# EasyEDA Pro project bandolibre.eprj, schematic GatedWingConnector
Board Name: GatedWingConnector; Create Date: 2026-05-05; Page Name: P1; Project Name: bandoneo; Schematic Name: GatedWingConnector; Update Date: 2026-05-05; Company: EasyEDA.com; Page Size: A4; Version: V1.0
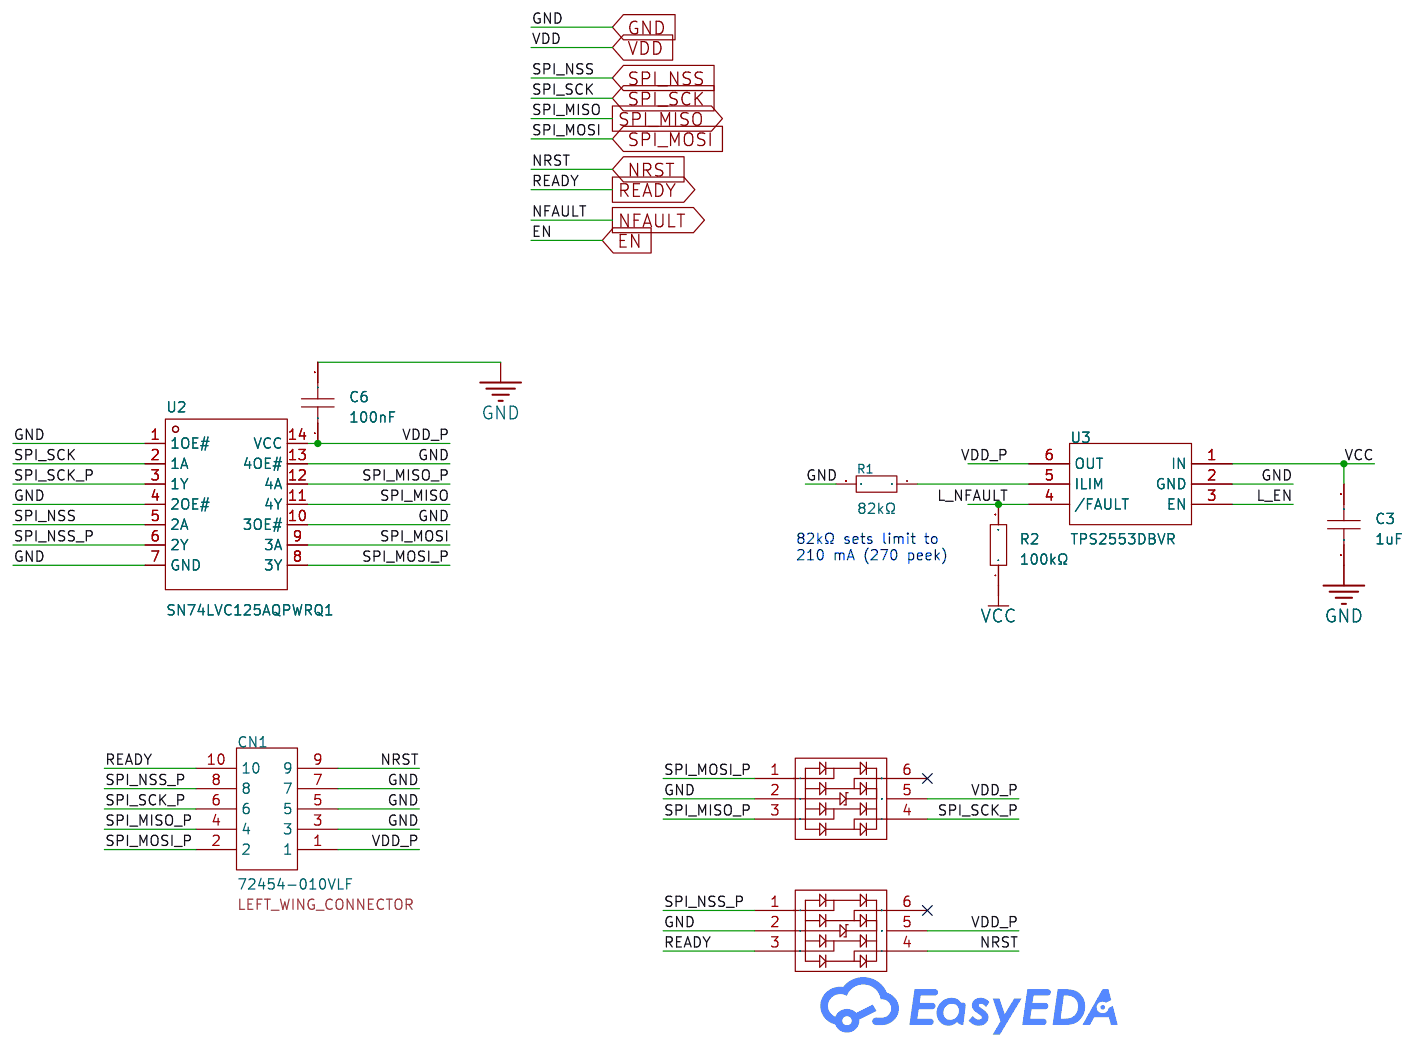
[diagram p1: schematic sheet]

## Parts
C3  1uF  [C0603]
C6  100nF  [C0603]
CN1  72454-010VLF  [CONN-SMD_10P-P2.54_72454-010VLF]
R1  82kΩ  [R0603]
R2  100kΩ  [R0603]
TV1  SRV05-4-P-T7  [SOT-23-6_L2.9-W1.6-P0.95-LS2.8-BR]
TV2  SRV05-4-P-T7  [SOT-23-6_L2.9-W1.6-P0.95-LS2.8-BR]
U2  SN74LVC125AQPWRQ1  [TSSOP-14_L5.0-W4.4-P0.65-LS6.4-BL]
U3  TPS2553DBVR  [SOT-23-6_L2.9-W1.6-P0.95-LS2.8-BR]

## Library data of the parts
C3 = CL10A105KB8NNNC: Temperature Coefficient: Tolerance: Tolerance: Voltage Rated: Capacitance:; LCSC Part Name: 1uF(105) ±10% 50V; Supplier Part: C15849; Manufacturer: SAMSUNG(三星); Supplier Footprint: 0603; JLCPCB Part Class: Basic Part; Datasheet: https://atta.szlcsc.com/upload/public/pdf/source/20160103/1457707679084.pdf; Supplier: LCSC
C6 = CC0603KRX7R9BB104: Capacitance: Tolerance:±10% Tolerance:±10% Voltage Rated: Temperature Coefficient:; LCSC Part Name: 100nF ±10% 50V; Supplier Part: C14663; Manufacturer: YAGEO(国巨); Supplier Footprint: 0603; JLCPCB Part Class: Basic Part; Datasheet: https://atta.szlcsc.com/upload/public/pdf/source/20170116/1484561234239.pdf; Supplier: LCSC; Tolerance: ±10%
CN1 = 72454-010VLF: Pins Structure:2x5P Pitch:2.54mm Mounting Type:Surface Mount,Vertical Reference Series:- Number of Pins:10P Number of Rows:2 Number of PINs Per Row:5 Row Spacing:2.54mm Current Rating:1A Contact Material:Phosphor Bronze Contact Plating:Tin Operating Tempe; LCSC Part Name: 2x5P 间距:2.54mm 立贴; Supplier Part: C236047; Manufacturer: Amphenol; Supplier Footprint: SMD,P=2.54mm; JLCPCB Part Class: Extended Part; Datasheet: https://item.szlcsc.com/datasheet/72454-010VLF/235722.html; Supplier: LCSC; Pins Structure: 2x5P; Pitch: 2.54mm; Mounting Type: Surface Mount,Vertical; Number of Pins: 10P; Number of Rows: 2; Number of PINs Per Row: 5; Row Spacing: 2.54mm; Current Rating: 1A; Contact Material: Phosphor Bronze; Contact Plating: Tin; Operating Temperature: -65℃~+105℃; Comment: LEFT_WING_CONNECTOR
R1 = 0603WAF8202T5E: Type:Thick Film Resistor Resistance:82kΩ Tolerance:±1% Tolerance:±1% Power(Watts):100mW Voltage-Supply(Max):75V Temperature Coefficient:±100ppm/℃ Temperature Coefficient:±100ppm/℃ Operating Temperature:-55℃~+155℃ Operating Temperature:-55℃~+155℃; LCSC Part Name: 82kΩ ±1% 100mW 厚膜电阻; Supplier Part: C23254; Manufacturer: UNI-ROYAL(厚声); Supplier Footprint: 0603; JLCPCB Part Class: Basic Part; Datasheet: https://item.szlcsc.com/datasheet/0603WAF8202T5E/23981.html; Supplier: LCSC; Type: Thick Film Resistor; Tolerance: ±1%; Power(Watts): 100mW; Voltage-Supply(Max): 75V; Temperature Coefficient: ±100ppm/℃; Operating Temperature: -55℃~+155℃
R2 = 0603WAF1003T5E: Type:Thick Film Resistor Resistance:100kΩ Tolerance:±1% Tolerance:±1% Power(Watts):100mW Voltage-Supply(Max):75V Temperature Coefficient:±100ppm/℃ Temperature Coefficient:±100ppm/℃ Operating Temperature:-55℃~+155℃ Operating Temperature:-55℃~+155℃; LCSC Part Name: 100kΩ ±1% 100mW 厚膜电阻; Supplier Part: C25803; Manufacturer: UNI-ROYAL(厚声); Supplier Footprint: 0603; JLCPCB Part Class: Basic Part; Datasheet: https://item.szlcsc.com/datasheet/0603WAF1003T5E/26546.html; Supplier: LCSC; Type: Thick Film Resistor; Tolerance: ±1%; Power(Watts): 100mW; Voltage-Supply(Max): 75V; Temperature Coefficient: ±100ppm/℃; Operating Temperature: -55℃~+155℃
TV1 TV2 = SRV05-4-P-T7_C85364: Reverse Stand-Off Voltage (Vrwm):5V Clamping Voltage:12V Peak Pulse Current (Ipp):1A@8/20us Voltage - Breakdown:6V Type:TVS; Supplier Part: C85364; Manufacturer: PROTEK; Supplier Footprint: SOT-23-6; JLCPCB Part Class: Extended Part; Datasheet: https://atta.szlcsc.com/upload/public/pdf/source/20161024/1477288764689.pdf; Supplier: LCSC; Reverse Stand-Off Voltage (Vrwm): 5V; Clamping Voltage: 12V; Peak Pulse Current (Ipp): 1A@8/20us; Voltage - Breakdown: 6V; Type: TVS
U2 = SN74LVC125AQPWRQ1: Input type:- output type:Tri-State Voltage - Supply:1.65V~3.6V Voltage - Supply:1.65V~3.6V Number of Elements:4 Number of Bits per Element:1 Channel Type:- Current - Output Low(IOL):24mA Current - Output High(IOH):24mA Logic Family:74LVC Operating Tempera; LCSC Part Name: 三态输出，四路总线缓冲门; Supplier Part: C134144; Manufacturer: TI(德州仪器); Supplier Footprint: TSSOP-14; JLCPCB Part Class: Extended Part; Datasheet: https://www.ti.com/cn/lit/gpn/sn74lvc125a-q1; Supplier: LCSC; output type: Tri-State; Voltage - Supply: 1.65V~3.6V; Number of Elements: 4; Number of Bits per Element: 1; Current - Output Low(IOL): 24mA; Current - Output High(IOH): 24mA; Logic Family: 74LVC; Operating Temperature: -40℃~+125℃; Quiescent Current: 20uA; Propagation Delay: 2.5ns@3.3V,50pF
U3 = TPS2553DBVR: Type:High Side Switch Number of Channels:1 Control Input Logic:Active High Maximum Continuous Current:1.5A Voltage - Supply:2.5V~6.5V Voltage - Supply:2.5V~6.5V RDS(on):85mΩ Operating Temperature-:-40℃~+150℃ Operating Temperature-:-40℃~+150℃ Features:Ov; LCSC Part Name: 精密可调限流电源分配开关; Supplier Part: C55266; Manufacturer: TI(德州仪器); Supplier Footprint: SOT-23-6; JLCPCB Part Class: Extended Part; Datasheet: https://www.ti.com/cn/lit/gpn/tps2553; Supplier: LCSC; Type: High Side Switch; Number of Channels: 1; Control Input Logic: Active High; Maximum Continuous Current: 1.5A; Voltage - Supply: 2.5V~6.5V; RDS(on): 85mΩ; Operating Temperature	-: -40℃~+150℃; Features: Overtemperature protection (OTP)；Overcurrent Protection(OCP)

## Nets
GND: C3.1 C6.2 CN1.3 CN1.5 CN1.7 R1.2 TV1.2 TV2.2 U2.1(1OE#) U2.4(2OE#) U2.7(GND) U2.10(3OE#) U2.13(4OE#) U3.2(GND)
VCC: C3.2 R2.1 U3.1(IN)
VDD_P: C6.1 CN1.1 TV1.5 TV2.5 U2.14(VCC) U3.6(OUT)
L_EN: U3.3(EN)
L_NFAULT: R2.2 U3.4(/FAULT)
NRST: CN1.9 TV2.4
READY: CN1.10 TV2.3
SPI_MISO: U2.11(4Y)
SPI_MISO_P: CN1.4 TV1.3 U2.12(4A)
SPI_MOSI: U2.9(3A)
SPI_MOSI_P: CN1.2 TV1.1 U2.8(3Y)
SPI_NSS: U2.5(2A)
SPI_NSS_P: CN1.8 TV2.1 U2.6(2Y)
SPI_SCK: U2.2(1A)
SPI_SCK_P: CN1.6 TV1.4 U2.3(1Y)
$1N407: R1.1 U3.5(ILIM)

Not connected (* = marked no-connect by the designer): TV1 6*; TV2 6*

## Notes on the sheet
- 82kΩ sets limit to
  210 mA (270 peek)
